# EAGLE design Radio_Module_2 (EAGLE 9.0.1)
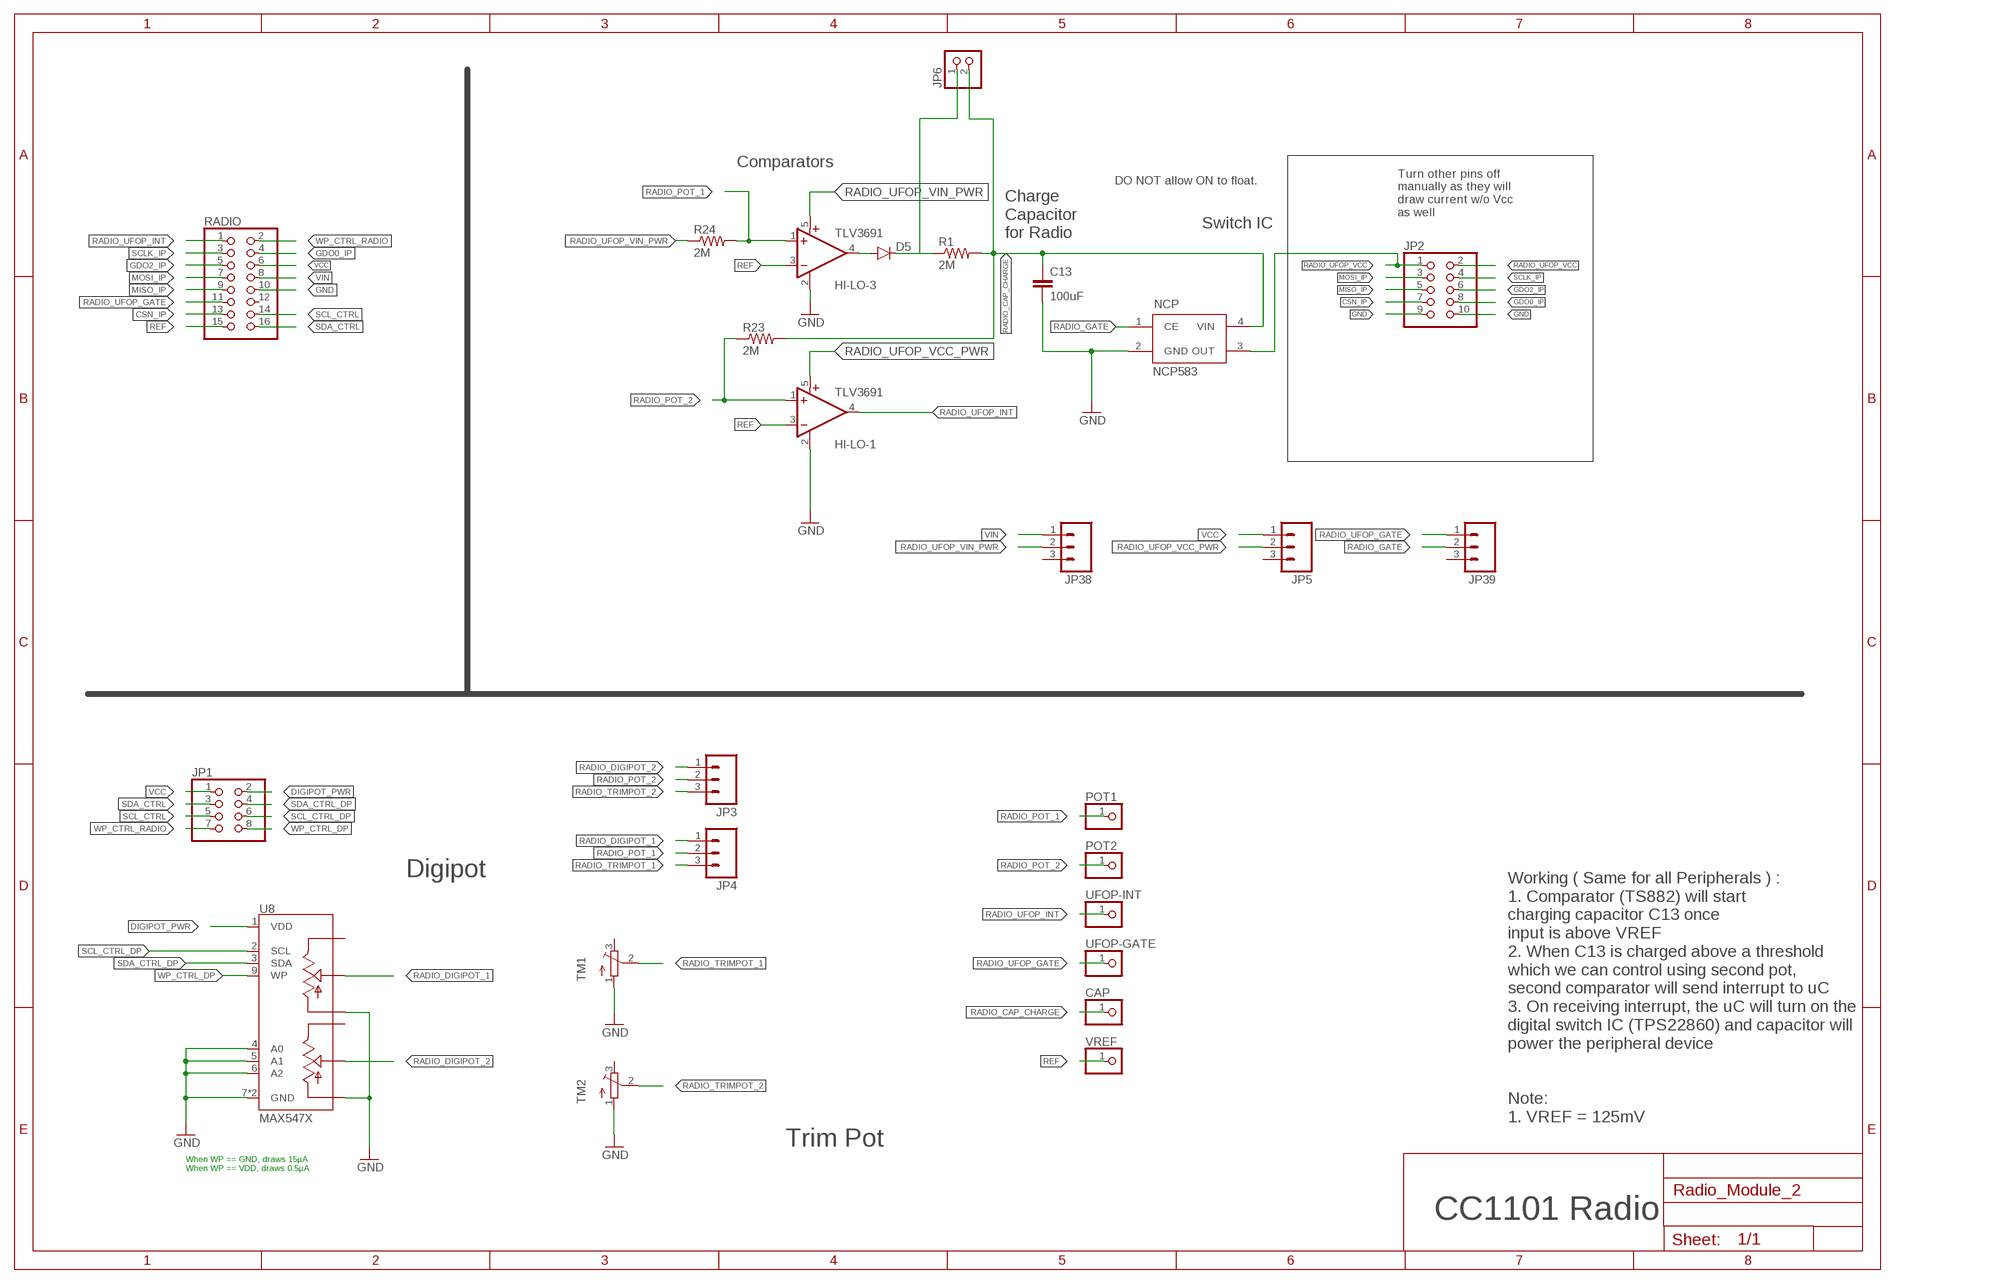
[diagram p0: schematic, sheet 1]

## Parts
C13  100uF  CAP0805  [0805]
CAP  PINHD-1X1  [1X01]
D5  DIODESOD523  [SOD523]
HI-LO-1  TLV3691  [SC70-5]
HI-LO-3  TLV3691  [SC70-5]
JP1  PINHD-2X4  [2X04]
JP2  PINHD-2X5  [2X05]
JP3  M03  [1X03-1.27MM]
JP4  M03  [1X03-1.27MM]
JP5  M03  [1X03-1.27MM]
JP6  PINHD-1X2  [1X02]
JP38  M03  [1X03-1.27MM]
JP39  M03  [1X03-1.27MM]
NCP  NCP583  [SC82-AB_1PRIMARY]
POT1  PINHD-1X1  [1X01]
POT2  PINHD-1X1  [1X01]
R1  2M  RESISTOR0805-RES  [0805]
R23  2M  RESISTOR0805-RES  [0805]
R24  2M  RESISTOR0805-RES  [0805]
RADIO  PINHD-2X8/90  [2X08/90]
TM1  TRIMPOTTC33X  [TC33X]
TM2  TRIMPOTTC33X  [TC33X]
U8  MAX547X  [QFN16]
UFOP-GATE  PINHD-1X1  [1X01]
UFOP-INT  PINHD-1X1  [1X01]
VREF  PINHD-1X1  [1X01]

## Nets
CSN_IP: JP2.7 RADIO.13
DIGIPOT_PWR: JP1.2 U8.1(VDD)
GDO0_IP: JP2.8 RADIO.4
GDO2_IP: JP2.6 RADIO.5
GND: C13.2 HI-LO-1.2(GND) HI-LO-3.2(GND) JP2.9 JP2.10 NCP.2(GND) RADIO.10 TM1.1(A) TM2.1(A) U8.4(A0) U8.5(A1) U8.6(A2) U8.7(GND) U8.10(LB) U8.13(LA) U8.TH(GND)
MISO_IP: JP2.5 RADIO.9
MOSI_IP: JP2.3 RADIO.7
N$1: D5.C JP6.1 R1.1
N$24: D5.A HI-LO-3.4(OUT)
RADIO_CAP_CHARGE: C13.1 CAP.1 JP6.2 NCP.4(VIN) R1.2 R23.2
RADIO_DIGIPOT_1: JP4.1 U8.14(WA)
RADIO_DIGIPOT_2: JP3.1 U8.11(WB)
RADIO_GATE: JP39.2 NCP.1(CE)
RADIO_POT_1: HI-LO-3.1(+IN) JP4.2 POT1.1 R24.2
RADIO_POT_2: HI-LO-1.1(+IN) JP3.2 POT2.1 R23.1
RADIO_TRIMPOT_1: JP4.3 TM1.2(S)
RADIO_TRIMPOT_2: JP3.3 TM2.2(S)
RADIO_UFOP_GATE: JP39.1 RADIO.11 UFOP-GATE.1
RADIO_UFOP_INT: HI-LO-1.4(OUT) RADIO.1 UFOP-INT.1
RADIO_UFOP_VCC: JP2.1 JP2.2 NCP.3(OUT)
RADIO_UFOP_VCC_PWR: HI-LO-1.5(V+) JP5.2
RADIO_UFOP_VIN_PWR: HI-LO-3.5(V+) JP38.2 R24.1
REF: HI-LO-1.3(-IN) HI-LO-3.3(-IN) RADIO.15 VREF.1
SCL_CTRL: JP1.5 RADIO.14
SCL_CTRL_DP: JP1.6 U8.2(SCL)
SCLK_IP: JP2.4 RADIO.3
SDA_CTRL: JP1.3 RADIO.16
SDA_CTRL_DP: JP1.4 U8.3(SDA)
VCC: JP1.1 JP5.1 RADIO.6
VIN: JP38.1 RADIO.8
WP_CTRL_DP: JP1.8 U8.9(WP)
WP_CTRL_RADIO: JP1.7 RADIO.2
Unconnected: JP5.3 JP38.3 JP39.3 RADIO.12 TM1.3(E) TM2.3(E) U8.12(HB) U8.15(HA)

## Notes on the sheet
- Comparators
- DO NOT allow ON to float.
- Charge 
  Capacitor 
  for Radio
- Turn other pins off 
  manually as they will
  draw current w/o Vcc
  as well
- Switch IC
- Digipot
- Working ( Same for all Peripherals ) :
  1. Comparator (TS882) will start 
  charging capacitor C13 once 
  input is above VREF
  2. When C13 is charged above a threshold
  which we can control using second pot, 
  second comparator will send interrupt to uC
  3. On receiving interrupt, the uC will turn on the
  digital switch IC (TPS22860) and capacitor will 
  power the peripheral device
- Note:
  1. VREF = 125mV
- Trim Pot
- When WP == GND, draws 15µA
  When WP == VDD, draws 0.5µA
- CC1101 Radio

## Library data of the parts
C13 = SparkFun-Capacitors:CAP: Capacitor Standard 0603 ceramic capacitor, and 0.1" leaded capacitor.; DIGIKEY: 490-9969-1-ND
CAP POT1 POT2 UFOP-GATE UFOP-INT VREF = adafruit:PINHD-1X1: Pin header 1x1 for 0.1" spacing With round pins
D5 = SparkFun-DiscreteSemi:DIODE: Diode These are standard reverse protection diodes and small signal diodes. SMA package can handle up to about 1A. SOD-323 can handle about 200mA. What the SOD-323 package when ordering, there are some mfgs out there that are 5-pin packages.
HI-LO-1 HI-LO-3 = fedpower:TLV3691: 0.9-V to 6.5-V, Nanopower Comparator Datasheets Analog Signal Chain Guide <http://www.ti.com/lit/pdf/slyb174> TLV3691 <http://www.ti.com/lit/ds/symlink/tlv3691.pdf> Manufacturer Product Page TLV3691IDPFR Specifications <http://www.ti.com/general/docs/suppproductinfo.tsp?distId=10&orderablePartNumber=TLV3691IDPFR> Standard Package <javascript:dlgHelp('Standard%20Packaging%20Help');> 1 Category Integrated Circuits (ICs) </product-search/en/integrated-circuits-ics> Family Linear - Comparators </product-search/en/integrated-circuits-ics/linear-comparators/2556221> Series - Packaging <javascript:dlgHelp('Standard%20Packaging%20Help');> Cut Tape (CT) <javascript:dlgHelp('Cut%20Tape%20Help');> Type General Purpose Number of Elements 1 Output Type Push-Pull Voltage - Supply, Single/Dual (±) 0.9 V ~ 6.5 V, ±0.45 V ~ 3.25 V Voltage - Input Offset (Max) 3mV Current - Input Bias (Max) 100pA Current - Output (Typ) 42mA Current - Quiescent (Max) 150nA CMRR, PSRR (Typ) - Propagation Delay (Max) 35µs Hysteresis - Operating Temperature -40°C ~ 125°C Package / Case 6-XFDFN Mounting Type Surface Mount Supplier Device Package 6-X2SON (1x1) Online Catalog Comparators - 1 element </catalog/en/partgroup/comparators-1-element/3112?mpart=TLV3691IDPFR&vendor=296&WT.z_ref_page_type=PS&WT.z_ref_page_sub_type=PD&WT.z_ref_page_id=PD&WT.z_ref_page_event=DC_Link_Table> Other Names 296-37242-1
JP1 = pinhead:PINHD-2X4: PIN HEADER
JP2 = pinhead:PINHD-2X5: PIN HEADER
JP3-JP5 JP38 JP39 = SparkFun-Connectors:M03: Header 3 Standard 3-pin 0.1" header. Use with straight break away headers (SKU : PRT-00116), right angle break away headers (PRT-00553), swiss pins (PRT-00743), machine pins (PRT-00117), and female headers (PRT-00115). Molex polarized connector foot print use with SKU : PRT-08232 with associated crimp pins and housings.
JP6 = pinhead:PINHD-1X2: PIN HEADER
NCP = ncp583:NCP583: NCP583 - Ultra-Low Iq 150 mA CMOS LDO Regulator with Enable The NCP583 series of low dropout regulators are designed for portable battery powered applications which require precise output voltage accuracy and low quiescent current. These devices feature an enable function which lowers current consumption significantly and are offered in two small packages; SC−82AB and the SOT−563. A 1.0 mF ceramic capacitor is the recommended value to be used with these devices on the output pin.
R1 R23 = SparkFun-Resistors:RESISTOR: Resistor Basic schematic elements and footprints for 0603, 1206, and PTH resistors.; DIGIKEY: 311-2.00MHRCT-ND
R24 = SparkFun-Resistors:RESISTOR: Resistor Basic schematic elements and footprints for 0603, 1206, and PTH resistors.
RADIO = pinhead:PINHD-2X8: PIN HEADER
TM1 TM2 = adafruit:TRIMPOT: SMT trimmer potentiometer part number TC33X http://www.ladyada.net/library/eagle
U8 = max547x:MAX547X: MAXIM MAX547X: Dual, 256-Tap, Nonvolatile, I2C-Interface, Digital Potentiometers, 400nA Iq, 250µA 12ms write The MAX5477/MAX5478/MAX5479 nonvolatile, dual, linear-taper, digital potentiometers perform the function of a mechanical potentiometer, but replace the mechanics with a simple 2-wire digital interface. Each device performs the same function as a discrete potentiometer or variable resistor and has 256 tap points. The devices feature an internal, nonvolatile EEPROM used to store the wiper position for initialization during power-up. A write-protect feature prevents accidental overwrites of the EEPROM. The fast-mode I2C-compatible serial interface allows communication at data rates up to 400kbps, minimizing board space and reducing interconnection complexity in many applications. Three address inputs allow a total of eight unique address combinations.; DIGIKEY: MAX5479ETE+-ND

## Board
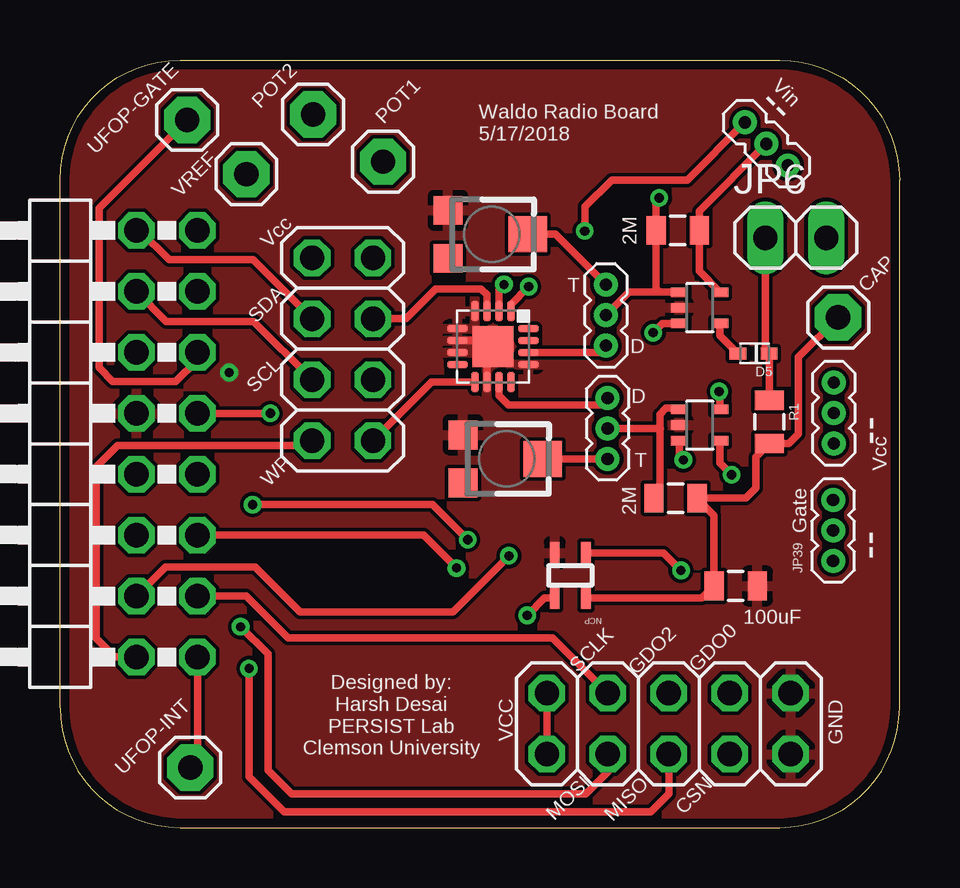
[diagram p1: board, top side]
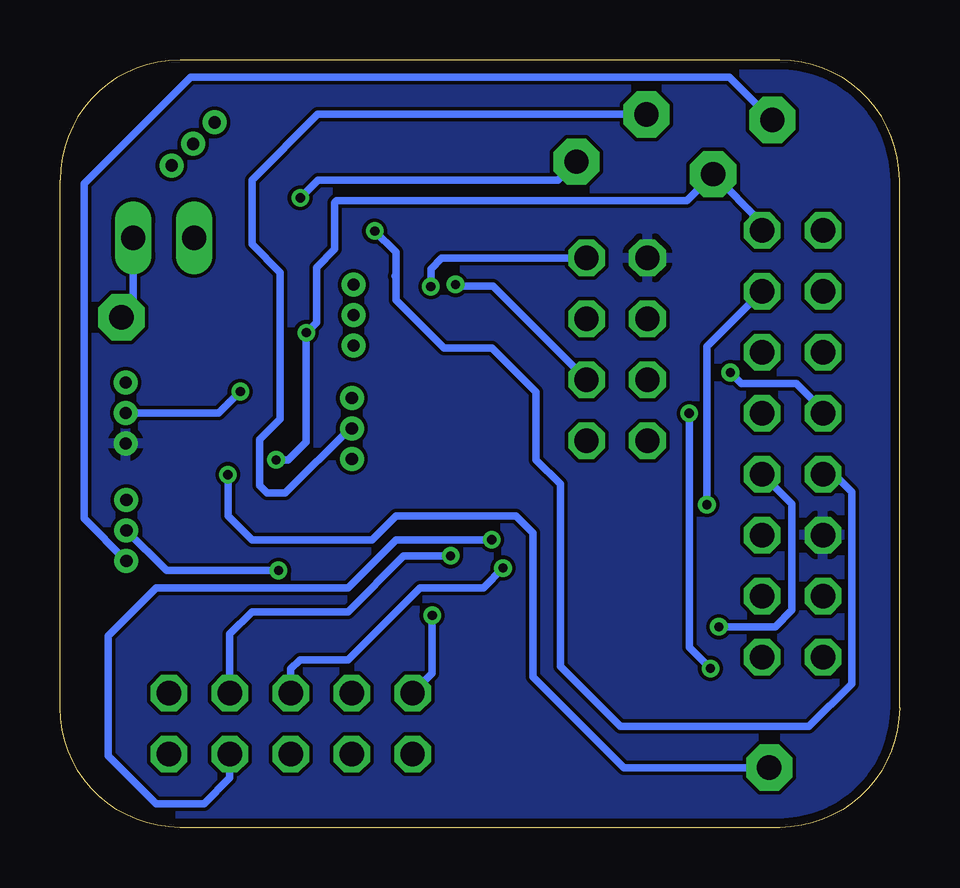
[diagram p2: board, bottom side, seen from below]

Size 35 x 32 mm. Coordinates in mm from the lower left corner, seen from the top.
Outline: 5,0 30,0 arc90 35,5 35,27 arc90 30,32 5,32 arc90 0,27 0,5 arc90 5,0
Copper layers (1*16): Top 0.0356mm / dielectric 1.5011mm / Bottom 0.0356mm
Design rules "oshpark-2layer": minimum track width 6mil, minimum drill 13mil, track to track 6mil, track to pad 6mil, pad to pad 6mil, via to via 6mil, smd to smd 6mil, copper to edge 15mil, drill to drill 6mil, minimum pad ring 7mil, minimum via ring 7mil, stop-mask expansion 2.5mil, vias tented up to drill 0mil, thermal gap 10mil

### Footprints (pad centres in the part's own frame; a part is rotated, then mirrored left to right if it is on the bottom)
0805 = smd 0.8 x 1.2: 1 -0.9,0; 2 0.9,0
1X01 = drill 1.016 pad 1.93 octagon: 1 0,0
SOD523 = smd 0.7 x 0.5: A 0.7,0; C -0.6,0
SC70-5 = smd 0.4 x 0.7: 1 -0.65,-0.85; 2 0,-0.85; 3 0.65,-0.85; 4 0.65,0.85; 5 -0.65,0.85
2X04 = drill 1.016 octagon: 1 -3.81,-1.27; 2 -3.81,1.27; 3 -1.27,-1.27; 4 -1.27,1.27; 5 1.27,-1.27; 6 1.27,1.27; 7 3.81,-1.27; 8 3.81,1.27
2X05 = drill 1.016 octagon: 1 -5.08,-1.27; 2 -5.08,1.27; 3 -2.54,-1.27; 4 -2.54,1.27; 5 0,-1.27; 6 0,1.27; 7 2.54,-1.27; 8 2.54,1.27; 9 5.08,-1.27; 10 5.08,1.27
1X03-1.27MM = drill 0.508 pad 1: 1 -1.27,0; 2 0,0; 3 1.27,0
1X02 = drill 1.016 long: 1 -1.27,0; 2 1.27,0
SC82-AB_1PRIMARY = smd 0.406 x 0.914: 1 -1.321,-0.813; 2 -0.025,-0.813; 3 -0.025,1.067; 4 -1.321,1.067
2X08/90 = drill 1.016 octagon: 1 -8.89,-6.35; 2 -8.89,-3.81; 3 -6.35,-6.35; 4 -6.35,-3.81; 5 -3.81,-6.35; 6 -3.81,-3.81; 7 -1.27,-6.35; 8 -1.27,-3.81; 9 1.27,-6.35; 10 1.27,-3.81; 11 3.81,-6.35; 12 3.81,-3.81; 13 6.35,-6.35; 14 6.35,-3.81; 15 8.89,-6.35; 16 8.89,-3.81
TC33X = smd 1.2 x 1.2: 1 -1,-1.825; 3 1,-1.825 | smd 1.5 x 1.6: 2 0,1.5
QFN16 = smd 0.85 x 0.3: 1 -1.475,0.75; 2 -1.475,0.25; 3 -1.475,-0.25; 4 -1.475,-0.75; 9 1.475,-0.75; 10 1.475,-0.25; 11 1.475,0.25; 12 1.475,0.75 | smd 0.3 x 0.85: 5 -0.75,-1.475; 6 -0.25,-1.475; 7 0.25,-1.475; 8 0.75,-1.475; 13 0.75,1.475; 14 0.25,1.475; 15 -0.25,1.475; 16 -0.75,1.475 | smd 1.7 x 1.7: TH 0,0

### Placement (x,y rotation side)
C13  28.17,10.07 0 top
CAP  32.44,21.27 0 top
D5  28.96,19.77 180 top
HI-LO-1  26.67,16.78 270 top
HI-LO-3  26.67,21.67 270 top
JP1  11.78,19.94 270 top
JP2  25.38,4.33 0 top
JP3  22.83,16.64 270 top
JP4  22.76,21.36 90 top
JP5  32.26,17.28 90 top
JP6  30.68,24.59 0 top
JP38  29.45,28.5 315 top
JP39  32.23,12.39 90 top
NCP  20.6,10.63 180 top
POT1  13.47,27.76 0 top
POT2  10.55,29.73 0 top
R1  29.57,16.92 270 top
R23  25.66,13.73 0 top
R24  25.75,24.9 180 top
RADIO  -0.62,16 90 top
TM1  18,24.73 270 top
TM2  18.63,15.37 270 top
U8  18.05,20.05 270 top
UFOP-GATE  5.3,29.5 0 top
UFOP-INT  5.43,2.5 0 top
VREF  7.77,27.24 0 top

### Tracks (layer width: path | path; a pad name or v marks a point on that pad's centre or on a via)
CSN_IP  (via drill 0.38)
  Top 0.305: v8.03,13.46 15.54,13.46 v17,12
  Bottom 0.305: v8.03,13.46 8.03,20.05 RADIO.13 | JP2.7 27.92,2.08 29,1 31,1 33,3 33,8 31,10 23,10 21,12 v17,12
DIGIPOT_PWR  (via drill 0.38)
  Top 0.305: U8.1 18.8,21.81 v19.54,22.55
  Bottom 0.305: v19.54,22.55 19.54,23.29 19.1,23.73 13.07,23.73 JP1.2
GDO0_IP  (via drill 0.38)
  Top 0.305: RADIO.4 4.4,10.86 8.14,10.86 10,9 16.39,9 v18.71,11.33
  Bottom 0.305: v18.71,11.33 20.67,11.33 23,9 27,9 27.92,8.08 JP2.8
GDO2_IP  (via drill 0.38)
  Top 0.305: RADIO.5 15.16,12.19 v16.53,10.82
  Bottom 0.305: v16.53,10.82 17.35,10 20,10 23,7 25,7 25.38,6.62 JP2.6
GND  (via drill 0.38)
  Top 0.305: U8.6 17.8,20.3 U8.TH 17.8,19.8 U8.10
  Bottom 0.305: RADIO.10 3.19,17.4 4.3,18.51 6.59,18.51 v7.05,18.97
  pour Top: -1,33 -1,-1 47,-1 47,33
MISO_IP  (via drill 0.38)
  Top 0.305: v8.77,17.27 RADIO.9 | JP2.5 25.38,1.4 24.63,0.65 9.35,0.65 7.88,2.12 v7.88,6.63
  Bottom 0.305: v8.77,17.27 8.77,7.52 v7.88,6.63
MOSI_IP  (via drill 0.38)
  Top 0.305: JP2.3 22.84,2.32 21.93,1.41 9.66,1.41 8.67,2.39 8.67,7.23 v7.53,8.37
  Bottom 0.305: RADIO.7 4.48,13.48 4.48,9.07 5.18,8.37 v7.53,8.37
N$1
  Top 0.305: R1.1 D5.C 29.41,19.92 JP6.1
N$24
  Top 0.305: HI-LO-3.4 27.52,20.51 D5.A
RADIO_CAP_CHARGE
  Top 0.305: R23.2 26.53,13.7 | 26.37,13.54 R23.2 | R23.2 28.59,13.73 29.01,14.15 29.01,15.46 R1.2 30.39,16.02 30.79,16.41 30.79,19.62 CAP.1 | R23.2 27.27,13.02 C13.1 26.77,9.57 NCP.4
  Bottom 0.305: CAP.1 31.95,21.76 JP6.2
RADIO_DIGIPOT_1
  Top 0.305: U8.14 22.47,19.8 JP4.1
RADIO_DIGIPOT_2
  Top 0.305: U8.11 18.3,18.01 18.69,17.62 22.54,17.62 JP3.1
RADIO_GATE  (via drill 0.38)
  Top 0.305: NCP.1 25.16,11.45 v25.89,10.72
  Bottom 0.305: JP39.2 30.56,10.72 v25.89,10.72
RADIO_POT_1  (via drill 0.38)
  Top 0.305: 25,22.32 HI-LO-3.1 | 25,22.32 23.72,22.32 JP4.2 | 25,22.32 24.85,22.47 R24.2 24.85,26.12 v24.98,26.25
  Bottom 0.305: v24.98,26.25 24.23,27 14.23,27 POT1.1
RADIO_POT_2
  Top 0.305: JP3.2 25,16.64 | 25,16.64 25.03,16.64 | 25,16.64 25,17.22 25.27,17.49 25.76,17.49 HI-LO-1.1 | 25,16.64 25,13.97 R23.1
  Bottom 0.305: JP3.2 22.91,16.64 25.61,13.94 26.36,13.94 26.68,14.26 26.68,16.18 25.82,17.04 25.82,23.14 27,24.32 27,27 24.27,29.73 POT2.1
RADIO_TRIMPOT_1
  Top 0.305: TM1.2 20.66,24.73 JP4.3
RADIO_TRIMPOT_2
  Top 0.305: TM2.2 JP3.3
RADIO_UFOP_GATE
  Top 0.305: RADIO.11 5.73,19.5 4.83,18.6 2.2,18.6 1.63,19.17 1.63,25.83 UFOP-GATE.1
  Bottom 0.305: UFOP-GATE.1 7.09,31.29 29.55,31.29 34,26.84 34,12.89 JP39.1
RADIO_UFOP_INT  (via drill 0.38)
  Top 0.305: RADIO.1 5.73,2.8 UFOP-INT.1 | HI-LO-1.4 27.52,15.19 v28,14.71
  Bottom 0.305: UFOP-INT.1 11.5,2.5 15.29,6.29 15.29,12.28 16,12.99 16,13 21,13 22,12 27,12 28,13 v28,14.71
RADIO_UFOP_VCC  (via drill 0.38)
  Top 0.305: JP2.2 JP2.1 | v19.48,8.84 20.21,9.57 NCP.3
  Bottom 0.305: JP2.2 19.48,6.42 v19.48,8.84
RADIO_UFOP_VCC_PWR  (via drill 0.38)
  Top 0.305: HI-LO-1.5 27.52,18.14 v27.48,18.18
  Bottom 0.305: JP5.2 28.38,17.28 v27.48,18.18
RADIO_UFOP_VIN_PWR
  Top 0.305: HI-LO-3.5 26.65,23.19 R24.1 26.65,25.7 JP38.2
REF  (via drill 0.38)
  Top 0.305: HI-LO-3.3 25.12,21.02 v24.73,20.63 | HI-LO-1.3 25.82,15.5 v25.99,15.33
  Bottom 0.305: v25.99,15.33 25.49,15.33 24.74,16.08 v24.74,20.62 v24.73,20.63 24.31,21.05 24.31,23.35 23.55,24.11 23.55,26.05 23.46,26.14 8.86,26.14 VREF.1 | 5.73,25.16 RADIO.15 5.73,25.2 VREF.1 | VREF.1
SCL_CTRL
  Top 0.305: RADIO.14 4.43,21.1 8.08,21.1 JP1.5
SCL_CTRL_DP  (via drill 0.38)
  Top 0.305: v18.51,22.64 18.3,22.43 U8.2
  Bottom 0.305: JP1.6 16.95,22.57 18.44,22.57 v18.51,22.64
SCLK_IP
  Top 0.305: RADIO.3 7.77,9.65 9.52,7.9 20.54,7.9 JP2.4
SDA_CTRL
  Top 0.305: RADIO.16 3.33,24.89 4.55,23.67 8.05,23.67 JP1.3
SDA_CTRL_DP
  Top 0.305: JP1.4 14.42,21.21 15.66,22.45 17.56,22.45 17.8,22.21 U8.3
VCC
  pour Bottom: -3,35 -3,-3 49,-3 49,35
VIN  (via drill 0.38)
  Top 0.305: v21.88,24.87 21.88,25.88 23,27 26.15,27 JP38.1
  Bottom 0.305: 21,23 21,22 19,20 17,20 15.16,18.16 15.16,15.33 14.14,14.31 14.14,6.72 11.63,4.21 3.79,4.21 2,6 2,14 2.73,14.73 RADIO.8 | 21,23 21.03,23 | 21,23 21,23.99 v21.88,24.87
WP_CTRL_DP
  Top 0.305: U8.9 15.49,18.57 JP1.8
WP_CTRL_RADIO
  Top 0.305: RADIO.2 2.29,7.11 1.51,7.89 1.51,15.04 2.4,15.93 10.31,15.93 JP1.7

### Text on the board
tPlace: -- | Vin | Waldo Radio Board / 5/17/2018 | Vcc | T | SDA | D | SCL | D | -- | T | Vcc | WP | Gate | -- | GDO0 | SCLK | GDO2 | Designed by: / Harsh Desai / PERSIST Lab / Clemson University | VCC | GND | MOSI | MISO | CSN